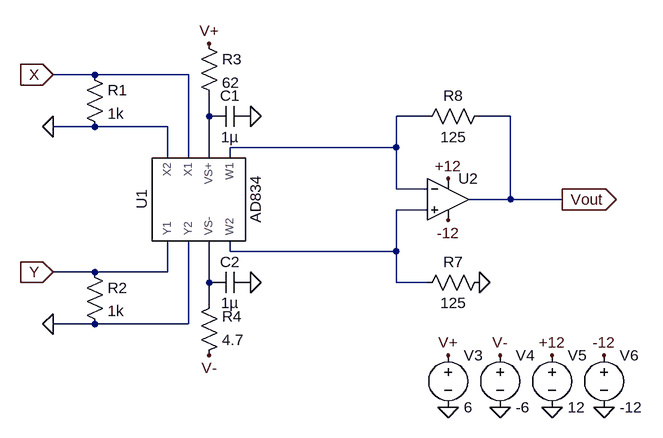
[diagram p0: schematic multiplier.asc]
multiplier.asc, the LTspice schematic file:
Version 4
SHEET 1 936 680
WIRE -64 16 -128 16
WIRE 80 16 -64 16
WIRE 112 80 112 48
WIRE 448 80 400 80
WIRE 576 80 528 80
WIRE -64 96 -128 96
WIRE 48 96 -64 96
WIRE 400 128 400 80
WIRE 400 128 144 128
WIRE 48 144 48 96
WIRE 80 144 80 16
WIRE 112 144 112 80
WIRE 144 144 144 128
WIRE 400 192 400 128
WIRE 448 192 400 192
WIRE 576 208 576 80
WIRE 576 208 512 208
WIRE 656 208 576 208
WIRE 448 224 400 224
WIRE 144 288 144 272
WIRE 400 288 400 224
WIRE 400 288 144 288
WIRE -64 320 -128 320
WIRE 48 320 48 272
WIRE 48 320 -64 320
WIRE 112 336 112 272
WIRE 400 336 400 288
WIRE 448 336 400 336
WIRE 112 368 112 336
WIRE -64 400 -128 400
WIRE 80 400 80 272
WIRE 80 400 -64 400
FLAG 560 528 0
FLAG 480 528 0
FLAG 480 448 V+
FLAG 560 448 V-
FLAG -128 400 0
FLAG -128 96 0
FLAG -128 16 X
IOPIN -128 16 In
FLAG -128 320 Y
IOPIN -128 320 In
FLAG 176 80 0
FLAG 176 336 0
FLAG 112 -32 V+
FLAG 112 448 V-
FLAG 640 528 0
FLAG 720 528 0
FLAG 640 448 +12
FLAG 720 448 -12
FLAG 480 176 +12
FLAG 480 240 -12
FLAG 528 336 0
FLAG 656 208 Vout
IOPIN 656 208 Out
SYMBOL AutoGenerated\\AD834 96 208 R270
SYMATTR InstName U1
SYMBOL voltage 480 432 R0
WINDOW 123 0 0 Left 0
WINDOW 39 0 0 Left 0
SYMATTR InstName V3
SYMATTR Value 6
SYMBOL voltage 560 432 R0
WINDOW 123 0 0 Left 0
WINDOW 39 0 0 Left 0
SYMATTR InstName V4
SYMATTR Value -6
SYMBOL res -80 0 R0
SYMATTR InstName R1
SYMATTR Value 1k
SYMBOL res -80 304 R0
SYMATTR InstName R2
SYMATTR Value 1k
SYMBOL res 96 -48 R0
SYMATTR InstName R3
SYMATTR Value 62
SYMBOL cap 176 64 R90
WINDOW 0 0 32 VBottom 2
WINDOW 3 32 32 VTop 2
SYMATTR InstName C1
SYMATTR Value 1µ
SYMBOL res 96 464 M180
WINDOW 0 36 76 Left 2
WINDOW 3 36 40 Left 2
SYMATTR InstName R4
SYMATTR Value 4.7
SYMBOL cap 176 352 M270
WINDOW 0 32 32 VTop 2
WINDOW 3 0 32 VBottom 2
SYMATTR InstName C2
SYMATTR Value 1µ
SYMBOL voltage 640 432 R0
WINDOW 123 0 0 Left 0
WINDOW 39 0 0 Left 0
SYMATTR InstName V5
SYMATTR Value 12
SYMBOL voltage 720 432 R0
WINDOW 123 0 0 Left 0
WINDOW 39 0 0 Left 0
SYMATTR InstName V6
SYMATTR Value -12
SYMBOL res 544 320 R90
WINDOW 0 0 56 VBottom 2
WINDOW 3 32 56 VTop 2
SYMATTR InstName R7
SYMATTR Value 125
SYMBOL res 544 64 R90
WINDOW 0 0 56 VBottom 2
WINDOW 3 32 56 VTop 2
SYMATTR InstName R8
SYMATTR Value 125
SYMBOL OpAmps\\UniversalOpAmp1 480 208 R0
SYMATTR InstName U2
SYMATTR Value2 Avol=1Meg GBW=10g Vos=0

The netlist it stands for:
* multiplier.asc
XU1 Y 0 N004 N003 N002 N001 X 0 AD834  ; pins Y1 Y2 VS- W2 W1 VS+ X1 X2
V3 V+ 0 6
V4 V- 0 -6
R1 X 0 1k
R2 Y 0 1k
R3 V+ N001 62
C1 0 N001 1µ
R4 V- N004 4.7
C2 0 N004 1µ
V5 +12 0 12
V6 -12 0 -12
R7 0 N003 125
R8 Vout N002 125
XU2 N003 N002 +12 -12 Vout level1 Avol=1Meg GBW=10g Vos=0 En=0 Enk=0 In=0 Ink=0 Rin=500Meg  ; pins In+ In- V+ V- OUT
.lib C:\Research\Code\spice\scratches\ad834.cir
.lib UniversalOpAmp1.lib
.backanno
.end